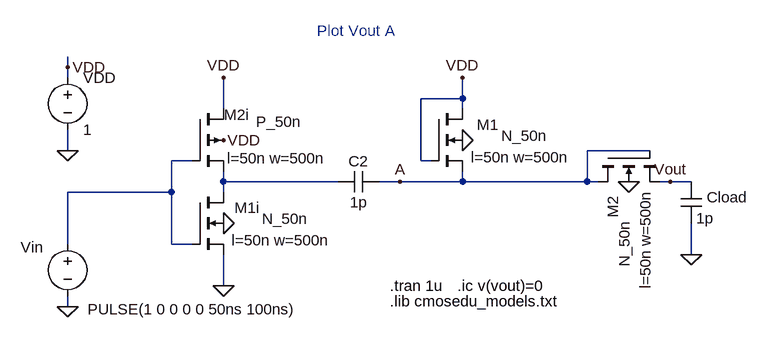
[diagram p0: schematic Fig18_34.asc]
Fig18_34.asc, the LTspice schematic file:
Version 4
SHEET 1 1472 680
WIRE 208 -368 208 -384
WIRE 208 -352 208 -368
WIRE 208 -240 208 -272
WIRE 208 -96 208 -176
WIRE 208 0 208 -16
WIRE 368 -176 208 -176
WIRE 368 -176 368 -224
WIRE 368 -96 368 -176
WIRE 400 -224 368 -224
WIRE 400 -96 368 -96
WIRE 448 -304 448 -352
WIRE 448 -192 448 -208
WIRE 448 -176 448 -192
WIRE 448 -32 448 -80
WIRE 624 -192 448 -192
WIRE 720 -192 688 -192
WIRE 752 -224 752 -320
WIRE 768 -224 752 -224
WIRE 816 -320 752 -320
WIRE 816 -320 816 -352
WIRE 816 -304 816 -320
WIRE 816 -192 720 -192
WIRE 816 -192 816 -208
WIRE 1008 -192 816 -192
WIRE 1008 -192 1008 -240
WIRE 1024 -192 1008 -192
WIRE 1104 -240 1008 -240
WIRE 1136 -192 1120 -192
WIRE 1168 -192 1136 -192
WIRE 1168 -80 1168 -128
FLAG 208 0 0
FLAG 1136 -192 Vout
FLAG 448 -128 0
FLAG 208 -240 0
FLAG 208 -368 VDD
FLAG 448 -256 VDD
FLAG 448 -32 0
FLAG 448 -352 VDD
FLAG 1168 -80 0
FLAG 1072 -192 0
FLAG 816 -256 0
FLAG 816 -352 VDD
FLAG 720 -192 A
SYMBOL nmos4 400 -176 R0
WINDOW 0 104 24 Right 0
WINDOW 3 179 41 Right 0
WINDOW 123 213 74 Right 0
SYMATTR InstName M1i
SYMATTR Value N_50n
SYMATTR Value2 l=50n w=500n
SYMBOL voltage 208 -112 R0
WINDOW 0 -72 21 Left 0
WINDOW 3 31 116 Left 0
WINDOW 123 0 0 Left 0
WINDOW 39 0 0 Left 0
SYMATTR InstName Vin
SYMATTR Value PULSE(1 0 0 0 0 50ns 100ns)
SYMBOL voltage 208 -368 R0
WINDOW 123 0 0 Left 0
WINDOW 39 0 0 Left 0
SYMATTR InstName VDD
SYMATTR Value 1
SYMBOL pmos4 400 -304 R0
WINDOW 0 88 9 Right 0
WINDOW 3 168 20 Right 0
WINDOW 123 206 76 Right 0
SYMATTR InstName M2i
SYMATTR Value P_50n
SYMATTR Value2 l=50n w=500n
SYMBOL cap 1152 -192 R0
WINDOW 0 40 24 Left 0
SYMATTR InstName Cload
SYMATTR Value 1p
SYMBOL nmos4 1024 -240 M90
WINDOW 0 104 24 Right 0
WINDOW 3 179 41 Right 0
WINDOW 123 213 74 Right 0
SYMATTR InstName M2
SYMATTR Value N_50n
SYMATTR Value2 l=50n w=500n
SYMBOL nmos4 768 -304 R0
WINDOW 0 104 24 Right 0
WINDOW 3 179 41 Right 0
WINDOW 123 213 74 Right 0
SYMATTR InstName M1
SYMATTR Value N_50n
SYMATTR Value2 l=50n w=500n
SYMBOL cap 688 -208 R90
WINDOW 0 0 32 VBottom 0
WINDOW 3 32 32 VTop 0
SYMATTR InstName C2
SYMATTR Value 1p
TEXT 704 -32 Left 0 !.tran 1u
TEXT 704 -8 Left 0 !.lib cmosedu_models.txt
TEXT 592 -424 Left 0 ;Plot Vout A
TEXT 808 -32 Left 0 !.ic v(vout)=0

The netlist it stands for:
* Fig18_34.asc
M1i N002 N001 0 0 N_50n l=50n w=500n
Vin N001 0 PULSE(1 0 0 0 0 50ns 100ns)
VDD VDD 0 1
M2i VDD N001 N002 VDD P_50n l=50n w=500n
Cload Vout 0 1p
M2 A A Vout 0 N_50n l=50n w=500n
M1 VDD VDD A 0 N_50n l=50n w=500n
C2 A N002 1p
.model NMOS NMOS
.model PMOS PMOS
.lib standard.mos
.tran 1u
.lib cmosedu_models.txt
* Plot Vout A
.ic v(vout)=0
.backanno
.end